# Altium schematic sheet bus_amplifier.SchDoc
size A2
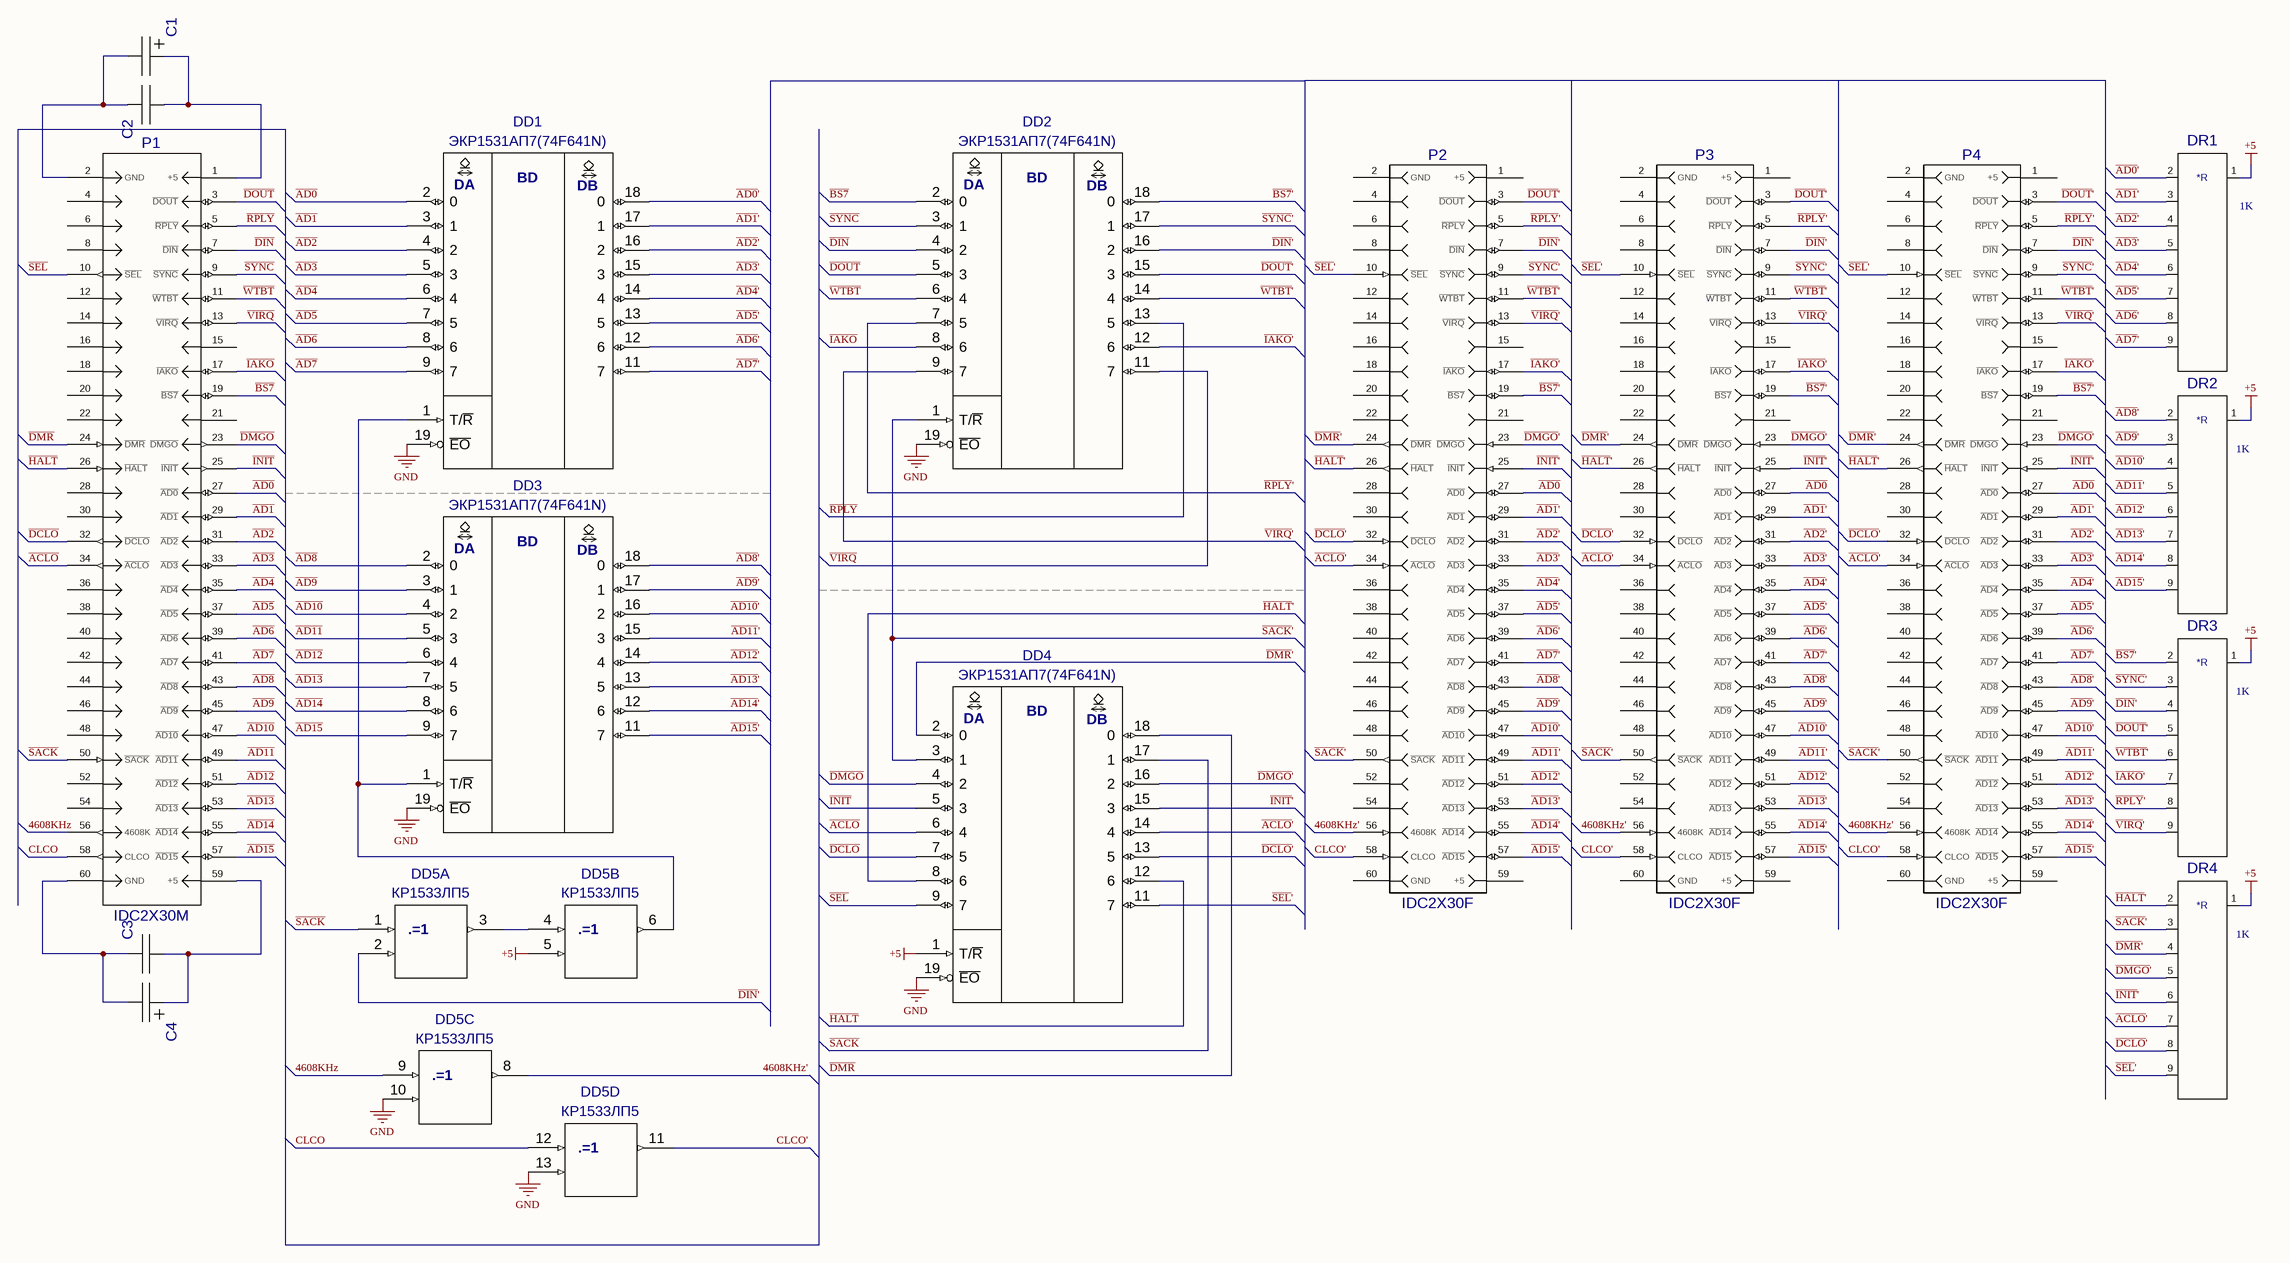
[diagram p0: bus_amplifier.SchDoc]

## Parts
C1  K5035-26  [K5035-8]  (value not drawn)
C2  K1017-1  [K1017-1_K1017-1A]  (value not drawn)
C3  K1017-1  [K1017-1_K1017-1A]  (value not drawn)
C4  K5035-26  [K5035-8]  (value not drawn)
DD1  ЭКР1531АП7(74F641N)  [2140.20-4]
DD2  ЭКР1531АП7(74F641N)  [2140.20-4]
DD3  ЭКР1531АП7(74F641N)  [2140.20-4]
DD4  ЭКР1531АП7(74F641N)  [2140.20-4]
DD5  КР1533ЛП5  [2101.14-1]  (parts A,B,C,D of 4)
DR1  value 1K  [NR1-4-8M]  (hidden comment: NR1-4-8M)
DR2  value 1K  [NR1-4-8M]  (hidden comment: NR1-4-8M)
DR3  value 1K  [NR1-4-8M]  (hidden comment: NR1-4-8M)
DR4  value 1K  [NR1-4-8M]  (hidden comment: NR1-4-8M)
P1  IDC2X30M  [IDC60M]
P2  IDC2X30F  [IDC60F]
P3  IDC2X30F  [IDC60F]
P4  IDC2X30F  [IDC60F]

## Nets
+5: DD4.1(T/~{R}) DD5.5 DR1.1(I/O1) DR2.1(I/O1) DR3.1(I/O1) DR4.1(I/O1)
GND: DD1.19(~{EO}) DD2.19(~{EO}) DD3.19(~{EO}) DD4.19(~{EO}) DD5.10 DD5.13
4608KHz: DD5.9 P1.56(4608K)
4608KHz': DD5.8 P2.56(4608K) P3.56(4608K) P4.56(4608K)
~{ACLO}: DD4.6(4) P1.34(~{ACLO})
~{ACLO}': DD4.14(4) DR4.7(I/O7) P2.34(~{ACLO}) P3.34(~{ACLO}) P4.34(~{ACLO})
~{AD0}: DD1.2(0) P1.27(~{AD0}) P2.27(~{AD0}) P3.27(~{AD0}) P4.27(~{AD0})
~{AD0}': DD1.18(0) DR1.2(I/O2)
~{AD1}: DD1.3(1) P1.29(~{AD1})
~{AD10}: DD3.4(2) P1.47(~{AD10})
~{AD10}': DD3.16(2) DR2.4(I/O4) P2.47(~{AD10}) P3.47(~{AD10}) P4.47(~{AD10})
~{AD11}: DD3.5(3) P1.49(~{AD11})
~{AD11}': DD3.15(3) DR2.5(I/O5) P2.49(~{AD11}) P3.49(~{AD11}) P4.49(~{AD11})
~{AD12}: DD3.6(4) P1.51(~{AD12})
~{AD12}': DD3.14(4) DR2.6(I/O6) P2.51(~{AD12}) P3.51(~{AD12}) P4.51(~{AD12})
~{AD13}: DD3.7(5) P1.53(~{AD13})
~{AD13}': DD3.13(5) DR2.7(I/O7) P2.53(~{AD13}) P3.53(~{AD13}) P4.53(~{AD13})
~{AD14}: DD3.8(6) P1.55(~{AD14})
~{AD14}': DD3.12(6) DR2.8(I/O8) P2.55(~{AD14}) P3.55(~{AD14}) P4.55(~{AD14})
~{AD15}: DD3.9(7) P1.57(~{AD15})
~{AD15}': DD3.11(7) DR2.9(I/O9) P2.57(~{AD15}) P3.57(~{AD15}) P4.57(~{AD15})
~{AD1}': DD1.17(1) DR1.3(I/O3) P2.29(~{AD1}) P3.29(~{AD1}) P4.29(~{AD1})
~{AD2}: DD1.4(2) P1.31(~{AD2})
~{AD2}': DD1.16(2) DR1.4(I/O4) P2.31(~{AD2}) P3.31(~{AD2}) P4.31(~{AD2})
~{AD3}: DD1.5(3) P1.33(~{AD3})
~{AD3}': DD1.15(3) DR1.5(I/O5) P2.33(~{AD3}) P3.33(~{AD3}) P4.33(~{AD3})
~{AD4}: DD1.6(4) P1.35(~{AD4})
~{AD4}': DD1.14(4) DR1.6(I/O6) P2.35(~{AD4}) P3.35(~{AD4}) P4.35(~{AD4})
~{AD5}: DD1.7(5) P1.37(~{AD5})
~{AD5}': DD1.13(5) DR1.7(I/O7) P2.37(~{AD5}) P3.37(~{AD5}) P4.37(~{AD5})
~{AD6}: DD1.8(6) P1.39(~{AD6})
~{AD6}': DD1.12(6) DR1.8(I/O8) P2.39(~{AD6}) P3.39(~{AD6}) P4.39(~{AD6})
~{AD7}: DD1.9(7) P1.41(~{AD7})
~{AD7}': DD1.11(7) DR1.9(I/O9) P2.41(~{AD7}) P3.41(~{AD7}) P4.41(~{AD7})
~{AD8}: DD3.2(0) P1.43(~{AD8})
~{AD8}': DD3.18(0) DR2.2(I/O2) P2.43(~{AD8}) P3.43(~{AD8}) P4.43(~{AD8})
~{AD9}: DD3.3(1) P1.45(~{AD9})
~{AD9}': DD3.17(1) DR2.3(I/O3) P2.45(~{AD9}) P3.45(~{AD9}) P4.45(~{AD9})
~{BS7}: DD2.2(0) P1.19(~{BS7})
~{BS7}': DD2.18(0) DR3.2(I/O2) P2.19(~{BS7}) P3.19(~{BS7}) P4.19(~{BS7})
CLCO: DD5.12 P1.58(CLCO)
CLCO': DD5.11 P2.58(CLCO) P3.58(CLCO) P4.58(CLCO)
~{DCLO}: DD4.7(5) P1.32(~{DCLO})
~{DCLO}': DD4.13(5) DR4.8(I/O8) P2.32(~{DCLO}) P3.32(~{DCLO}) P4.32(~{DCLO})
~{DIN}: DD2.4(2) P1.7(~{DIN})
~{DIN}': DD2.16(2) DD5.2 DR3.4(I/O4) P2.7(~{DIN}) P3.7(~{DIN}) P4.7(~{DIN})
~{DMGO}: DD4.4(2) P1.23(~{DMGO})
~{DMGO}': DD4.16(2) DR4.5(I/O5) P2.23(~{DMGO}) P3.23(~{DMGO}) P4.23(~{DMGO})
~{DMR}: DD4.18(0) P1.24(~{DMR})
~{DMR}': DD4.2(0) DR4.4(I/O4) P2.24(~{DMR}) P3.24(~{DMR}) P4.24(~{DMR})
~{DOUT}: DD2.5(3) P1.3(~{DOUT})
~{DOUT}': DD2.15(3) DR3.5(I/O5) P2.3(~{DOUT}) P3.3(~{DOUT}) P4.3(~{DOUT})
~{HALT}: DD4.12(6) P1.26(~{HALT})
~{HALT}': DD4.8(6) DR4.2(I/O2) P2.26(~{HALT}) P3.26(~{HALT}) P4.26(~{HALT})
~{IAKO}: DD2.8(6) P1.17(~{IAKO})
~{IAKO}': DD2.12(6) DR3.7(I/O7) P2.17(~{IAKO}) P3.17(~{IAKO}) P4.17(~{IAKO})
~{INIT}: DD4.5(3) P1.25(~{INIT})
~{INIT}': DD4.15(3) DR4.6(I/O6) P2.25(~{INIT}) P3.25(~{INIT}) P4.25(~{INIT})
~{RPLY}: DD2.13(5) P1.5(~{RPLY})
~{RPLY}': DD2.7(5) DR3.8(I/O8) P2.5(~{RPLY}) P3.5(~{RPLY}) P4.5(~{RPLY})
~{SACK}: DD4.17(1) DD5.1 P1.50(~{SACK})
~{SACK}': DD2.1(T/~{R}) DD4.3(1) DR4.3(I/O3) P2.50(~{SACK}) P3.50(~{SACK}) P4.50(~{SACK})
~{SEL}: DD4.9(7) P1.10(~{SEL})
~{SEL}': DD4.11(7) DR4.9(I/O9) P2.10(~{SEL}) P3.10(~{SEL}) P4.10(~{SEL})
~{SYNC}: DD2.3(1) P1.9(~{SYNC})
~{SYNC}': DD2.17(1) DR3.3(I/O3) P2.9(~{SYNC}) P3.9(~{SYNC}) P4.9(~{SYNC})
~{VIRQ}: DD2.11(7) P1.13(~{VIRQ})
~{VIRQ}': DD2.9(7) DR3.9(I/O9) P2.13(~{VIRQ}) P3.13(~{VIRQ}) P4.13(~{VIRQ})
~{WTBT}: DD2.6(4) P1.11(~{WTBT})
~{WTBT}': DD2.14(4) DR3.6(I/O6) P2.11(~{WTBT}) P3.11(~{WTBT}) P4.11(~{WTBT})
NetC1_1: C1.1(I/OA) C2.2(I/OB) P1.1(+5)
NetC1_2: C1.2(I/OB) C2.1(I/OA) P1.2(GND)
NetC3_1: C3.1(I/OA) C4.2(I/OB) P1.60(GND)
NetC3_2: C3.2(I/OB) C4.1(I/OA) P1.59(+5)
NetDD1_1: DD1.1(T/~{R}) DD3.1(T/~{R}) DD5.6
NetDD5_3: DD5.3 DD5.4

Not connected (* = marked no-connect by the designer): DD1 10(GND) 20(+5V); DD2 10(GND) 20(+5V); DD3 10(GND) 20(+5V); DD4 10(GND) 20(+5V); DD5 7(GND) 14(+5V); P1 4 6 8 12 14 15(P8) 16(P8) 18 20 21(P11) 22(P11) 28 30 36 38 40 42 44 46 48 52 54; P2 1(+5) 2(GND) 4 6 8 12 14 15(P8) 16(P8) 18 20 21(P11) 22(P11) 28 30 36 38 40 42 44 46 48 52 54 59(+5) 60(GND); P3 1(+5) 2(GND) 4 6 8 12 14 15(P8) 16(P8) 18 20 21(P11) 22(P11) 28 30 36 38 40 42 44 46 48 52 54 59(+5) 60(GND); P4 1(+5) 2(GND) 4 6 8 12 14 15(P8) 16(P8) 18 20 21(P11) 22(P11) 28 30 36 38 40 42 44 46 48 52 54 59(+5) 60(GND)

## Notes on the sheet
- (in symbol 74F641) BD; DA; DB
- (in symbol NR1-4-8M) *R
- (in symbol КР1533ЛП5, part A) .=1
- (in symbol КР1533ЛП5, part B) .=1
- (in symbol КР1533ЛП5, part C) .=1
- (in symbol КР1533ЛП5, part D) .=1

## Library data of the parts
C1 C4 = K5035-26: PDIF_TY: 11213; Value: *
C2 C3 = K1017-1: PDIF_TY: 11213; Value: *
DD1-DD4 = 74F641: Value: *
P1 = IDC2X30M_B: IDC Header; Value: *
P2-P4 = IDC2X30F_B: IDC Header; Value: *
DD5 = КР1533ЛП5: Value: *